# Altium schematic sheet LEDDriver.SchDoc
size A4
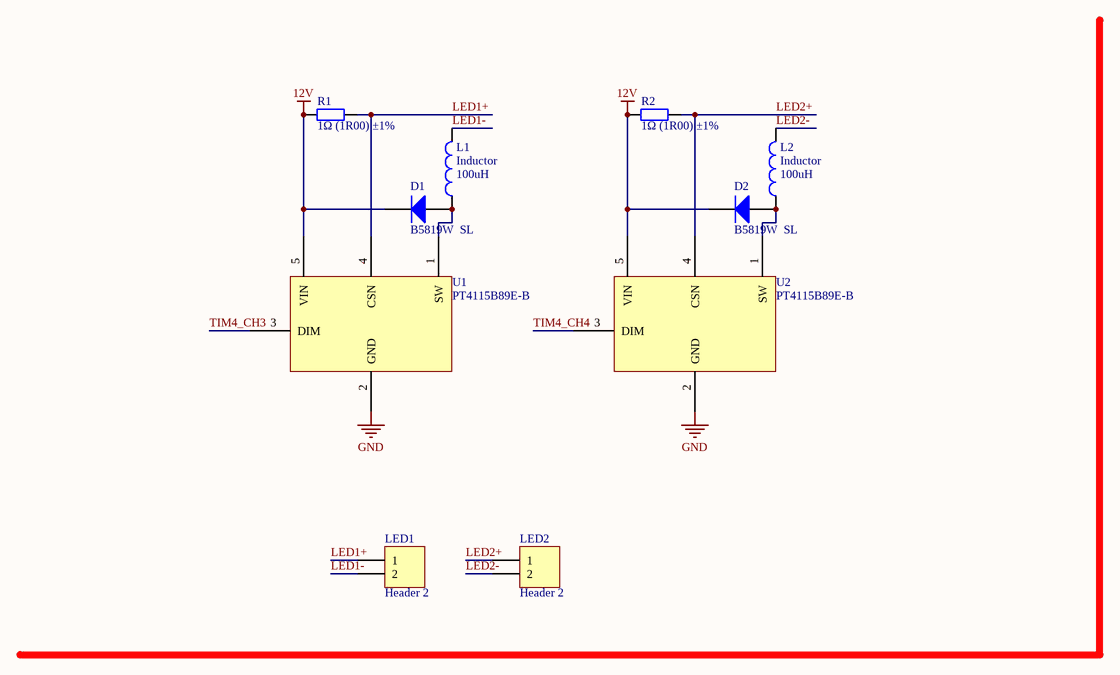
[diagram p0: LEDDriver.SchDoc]

## Parts
D1  B5819W  SL  [SOD-123]
D2  B5819W  SL  [SOD-123]
L1  Inductor  value 100uH  [L0630(6x7x3)]
L2  Inductor  value 100uH  [L0630(6x7x3)]
LED1  Header 2  [XH2.54_2P]
LED2  Header 2  [XH2.54_2P]
R1  1Ω (1R00) ±1%  [1206_R]
R2  1Ω (1R00) ±1%  [1206_R]
U1  PT4115B89E-B  [SOT89-150P420X160-5M]
U2  PT4115B89E-B  [SOT89-150P420X160-5M]

## Nets
12V: D1.2(K) D2.2(K) R1.1 R2.1 U1.5(VIN) U2.5(VIN)
GND: U1.2(GND) U2.2(GND)
LED1+: LED1.1 R1.2 U1.4(CSN)
LED1-: L1.2 LED1.2
LED2+: LED2.1 R2.2 U2.4(CSN)
LED2-: L2.2 LED2.2
TIM4_CH3: U1.3(DIM)
TIM4_CH4: U2.3(DIM)
NetD1_1: D1.1(A) L1.1 U1.1(SW)
NetD2_1: D2.1(A) L2.1 U2.1(SW)

## Library data of the parts
D1 D2 = SOD-123 B5819W  SL: 肖特基二极管; ComponentLink1Description: 供应商链接; ComponentLink1URL: http://www.szlcsc.com/product/details_9093.html; Package: SOD-123; Supplier: LC; SuppliersPartNumber: C8598
L1 L2 = Inductor: Code_IEC: 1005; Published: 8-Jun-2000; LatestRevisionDate: 29-May-2009; LatestRevisionNote: IPC-7351 Footprint Added.; PackageReference: 0402-A; Publisher: Altium Limited; PackageDescription: Chip Inductor; Code_JEITA: 0402
LED1 LED2 = Header 2: Header, 2-Pin; LatestRevisionDate: 17-Jul-2002; LatestRevisionNote: Re-released for DXP Platform.; Publisher: Altium Limited
R1 R2 = 1206 1Ω (1R00) 1%: 贴片电阻; ComponentLink1Description: 供应商链接; ComponentLink1URL: http://www.szlcsc.com/product/details_18616.html; Package: 1206; Supplier: LC; SuppliersPartNumber: C17928